# Altium schematic sheet 12-RS485.SchDoc
size A4
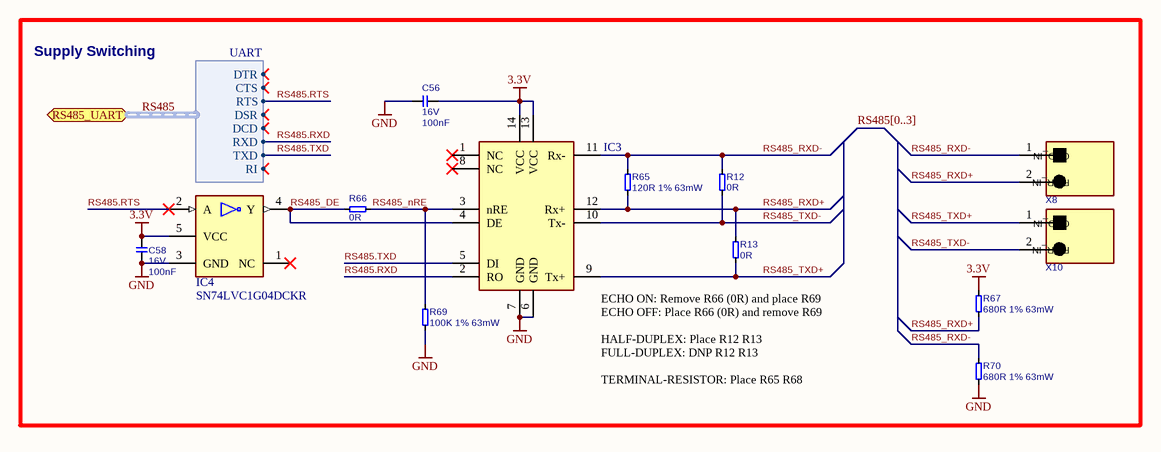
[diagram p0: 12-RS485.SchDoc]

## Parts
C56  value 100nF  Rating: 16V  [CAPC1005X60N]  (hidden comment: 100nF 16V 10% X7R)
C58  value 100nF  Rating: 16V  [CAPC1005X60N]  (hidden comment: 100nF 16V 10% X7R)
IC3  ISL83491IBZ-T  [SOIC127P600X175-14N]  (value not drawn)
IC4  SN74LVC1G04DCKR  [SOT65P210X110-5N]
R12  0R  [RESC1005X40N]
R13  0R  [RESC1005X40N]
R65  120R 1% 63mW  [RESC1005X40N]
R66  0R  [RESC1005X40N]
R67  680R 1% 63mW  [RESC1005X40N]
R69  100K 1% 63mW  [RESC1005X40N]
R70  680R 1% 63mW  [RESC1005X40N]
X8  1984617  [TERM-BLK-3.5MM]  (value not drawn)
X10  1984617  [TERM-BLK-3.5MM]  (value not drawn)

## Blocks framed on the sheet
Supply Switching: C56 C58 IC3 IC4 R12 R13 R65-R67 R69 R70 X8 X10

## Ports
RS485_UART (bidir, harness UART)

## Harnesses
UART: RTS, DSR, DCD, RXD, TXD, CTS, DTR, RI

## Nets
3.3V: C56.1 C58.2 IC3.13(VCC) IC3.14(VCC) IC4.5(VCC) R67.2
GND: C56.2 C58.1 IC3.6(GND) IC3.7(GND) IC4.3(GND) R69.1 R70.1
RS485.RTS: IC4.2(A) ; port RS485_UART.RTS
RS485.RXD: IC3.2(RO) ; port RS485_UART.RXD
RS485.TXD: IC3.5(DI) ; port RS485_UART.TXD
RS485_DE: IC3.4(DE) IC4.4(Y) R66.2
RS485_nRE: IC3.3(nRE) R66.1 R69.2
RS485_RXD+: IC3.12(Rx+) R13.2 R65.1 R67.1 X8.2(PWR_IN)
RS485_RXD-: IC3.11(Rx-) R12.1 R65.2 R70.2 X8.1(GND_IN)
RS485_TXD+: IC3.9(Tx+) R13.1 X10.1(GND_IN)
RS485_TXD-: IC3.10(Tx-) R12.2 X10.2(PWR_IN)

Not connected (* = marked no-connect by the designer): IC3 1(NC)* 8(NC)*; IC4 1(NC)*

## Buses and harness runs
bus RS485[0..3]
harness RS485 = port RS485_UART

## Notes on the sheet
- ECHO ON: Remove R66 (0R) and place R69
  ECHO OFF: Place R66 (0R) and remove R69
  HALF-DUPLEX: Place R12 R13
  FULL-DUPLEX: DNP R12 R13
  TERMINAL-RESISTOR: Place R65 R68

## Library data of the parts
C56 C58 = C-100nF-16V-10%-0603: Capacitor Ceramic X7R 100nF 16V 10% 0603; FP_DESC: C0402; Tolerance: 10%; Type: X7R; Supplier 1: Digi-Key; Supplier Part Number 1: 1276-1001-1-ND; Footprint Checked: -; MFG: *; MFG_PN: *
IC3 = IC-Renesas-ISL83491IBZ-T: Transceptor 1/1 Completo RS422, RS485 14-SOIC; MFG: Renesas Electronics America Inc; Supplier 1: Digi-Key; Supplier Part Number 1: ISL83491IBZ-TCT-ND; Symbol Checked: -; Footprint Checked: -; MFG_PN: ISL83491IBZ-T
IC4 = IC-TI-SN74LVC1G04: IC INVERTER 1CH 1-INP SC70-5; Symbol Checked: M - D; MFG: Texas Instruments; Supplier 1: Digi-Key; Supplier Part Number 1: 296-11600-1-ND; Footprint Checked: -; MFG_PN: SN74LVC1G04
R12 R13 R66 = R-0R-0402: Resistor 0ohm 0402; Tolerance: 1%; MFG: <GENERIC>; Power: ?; Value: 0R; Footprint: R0402; Supplier 1: Digi-Key; Supplier Part Number 1: 541-2952-1-ND; Footprint Checked: -; MFG_PN: <GENERIC>; Symbol Checked: -
R65 = R-120R-1%-0402: Resistor 120ohm 63mW 1% 0402; MFG: <GENERIC>; Power: 63mW; Tolerance: 1%; Footprint: R0402; Value: 120R; Supplier 1: Digi-Key; Supplier Part Number 1: 541-120LCT-ND; Footprint Checked: -; Symbol Checked: -; MFG_PN: <GENERIC>
R67 R70 = R-680R-1%-0402: Resistor 680ohm 63mW 1% 0402; Value: 680; MFG: <GENERIC>; Power: 63mW; Tolerance: 1%; Footprint: R0402; Supplier 1: Digi-Key; Supplier Part Number 1: 541-680LCT-ND; Footprint Checked: -; Symbol Checked: -; MFG_PN: <GENERIC>
R69 = R-100K-1%-0402: Resistor 100Kohm 63mW 1% 0402; Manufacturer: <GENERIC>; Replacement Allowed: Yes; Power: 63mW; Tolerance: 1%; Value: 100k; Footprint: R0402; Supplier 1: Digi-Key; Supplier Part Number 1: 541-100KLCT-ND; Manufacturer Part Number: <GENERIC>
X8 X10 = CON-Phoenix-1984617-1x2-3.5mm: 2 Position Wire to Board Terminal Block Horizontal with Board 0.138" (3.50mm) Through Hole; No. of ways: 1x2; Pitch: 3.5mm; MFG: Phoenix Contact; Supplier 1: Digi-Key; Supplier Part Number 1: 277-1721-ND; Footprint Checked: -; MFG_PN: 1984617; Symbol Checked: -